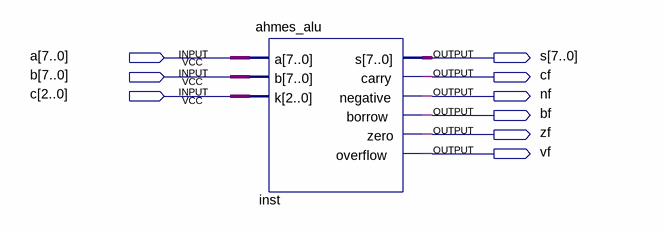
[diagram p0: schematic sheet]
// Quartus schematic final_work.bdf as structural Verilog: 1 symbols, 9 pins
module final_work (
  input  [7:0] a,
  input  [7:0] b,
  input  [2:0] c,
  output [7:0] s,
  output cf,
  output nf,
  output bf,
  output zf,
  output vf
);

  ahmes_alu inst (.a(a), .b(b), .k(c), .s(s), .carry(cf), .negative(nf), .borrow(bf), .zero(zf), .overflow(vf));
endmodule
